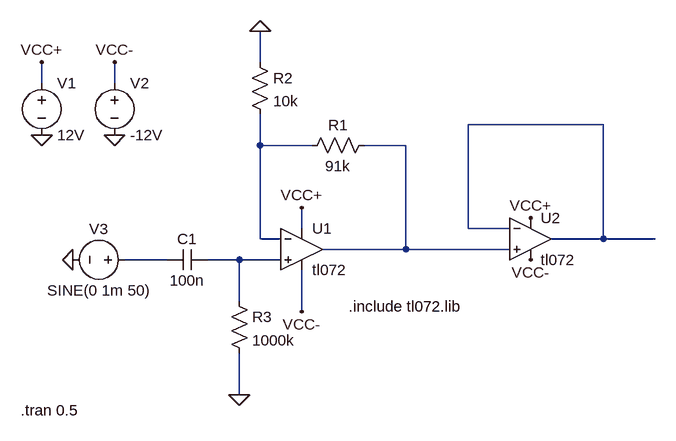
[diagram p0: schematic g_amp.asc]
g_amp.asc, the LTspice schematic file:
Version 4.1
SHEET 1 880 680
WIRE 192 -160 192 -208
WIRE -144 -128 -144 -160
WIRE -32 -128 -32 -160
WIRE 720 -64 512 -64
WIRE 192 -32 192 -80
WIRE 272 -32 192 -32
WIRE 416 -32 352 -32
WIRE 256 96 256 64
WIRE 512 96 512 -64
WIRE 576 96 512 96
WIRE 192 112 192 -32
WIRE 224 112 192 112
WIRE 720 112 720 -64
WIRE 720 112 640 112
WIRE 800 112 720 112
WIRE 416 128 416 -32
WIRE 416 128 288 128
WIRE 576 128 416 128
WIRE 48 144 -16 144
WIRE 160 144 112 144
WIRE 224 144 160 144
WIRE 160 208 160 144
WIRE 256 224 256 160
WIRE 160 352 160 288
FLAG -144 -48 0
FLAG -32 -48 0
FLAG -144 -160 VCC+
FLAG 256 64 VCC+
FLAG -32 -160 VCC-
FLAG 256 224 VCC-
FLAG 192 -208 0
FLAG -96 144 0
FLAG 608 144 VCC-
FLAG 608 80 VCC+
FLAG 160 352 0
SYMBOL OpAmps\\opamp2 256 64 R0
SYMATTR InstName U1
SYMATTR Value tl072
SYMBOL voltage -144 -144 R0
SYMATTR InstName V1
SYMATTR Value 12V
SYMBOL voltage -32 -144 R0
SYMATTR InstName V2
SYMATTR Value -12V
SYMBOL cap 112 128 R90
WINDOW 0 0 32 VBottom 2
WINDOW 3 32 32 VTop 2
SYMATTR InstName C1
SYMATTR Value 100n
SYMBOL res 368 -48 R90
WINDOW 0 0 56 VBottom 2
WINDOW 3 32 56 VTop 2
SYMATTR InstName R1
SYMATTR Value 91k
SYMBOL res 176 -176 R0
SYMATTR InstName R2
SYMATTR Value 10k
SYMBOL voltage 0 144 R90
WINDOW 0 -32 56 VBottom 2
WINDOW 3 32 56 VTop 2
WINDOW 123 0 0 Left 0
WINDOW 39 0 0 Left 0
SYMATTR InstName V3
SYMATTR Value SINE(0 1m 50)
SYMBOL OpAmps\\opamp2 608 48 R0
SYMATTR InstName U2
SYMATTR Value tl072
SYMBOL res 144 192 R0
SYMATTR InstName R3
SYMATTR Value 1000k
TEXT 328 216 Left 2 !.include tl072.lib
TEXT -176 376 Left 2 !.tran 0.5

The netlist it stands for:
* g_amp.asc
X§U1 N005 N002 VCC+ VCC- N003 tl072  ; pins In+ In- V+ V- OUT
V1 VCC+ 0 12V
V2 VCC- 0 -12V
C1 N005 N004 100n
R1 N003 N002 91k
R2 0 N002 10k
V3 N004 0 SINE(0 1m 50)
X§U2 N003 N001 VCC+ VCC- N001 tl072  ; pins In+ In- V+ V- OUT
R3 N005 0 1000k
.include tl072.lib
.tran 0.5
.backanno
.end